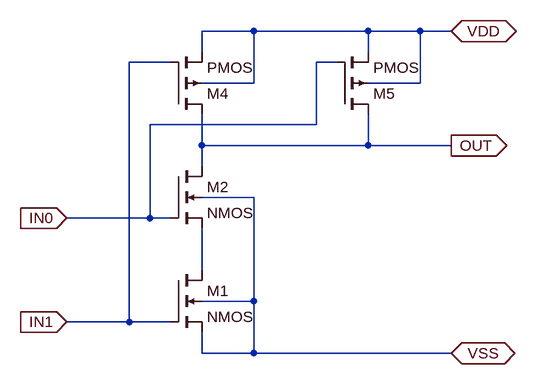
[diagram p0: schematic 2NAND.asc]
2NAND.asc, the LTspice schematic file:
Version 4
SHEET 1 880 680
WIRE 224 -224 144 -224
WIRE 400 -224 224 -224
WIRE 480 -224 400 -224
WIRE 528 -224 480 -224
WIRE 144 -192 144 -224
WIRE 400 -192 400 -224
WIRE 96 -176 32 -176
WIRE 352 -176 320 -176
WIRE 224 -144 224 -224
WIRE 224 -144 144 -144
WIRE 480 -144 480 -224
WIRE 480 -144 400 -144
WIRE 320 -80 320 -176
WIRE 320 -80 64 -80
WIRE 144 -48 144 -96
WIRE 400 -48 400 -96
WIRE 400 -48 144 -48
WIRE 528 -48 400 -48
WIRE 144 -16 144 -48
WIRE 224 32 144 32
WIRE 64 64 64 -80
WIRE 64 64 -64 64
WIRE 96 64 64 64
WIRE 144 144 144 80
WIRE 224 192 224 32
WIRE 224 192 144 192
WIRE 32 224 32 -176
WIRE 32 224 -64 224
WIRE 96 224 32 224
WIRE 144 272 144 240
WIRE 224 272 224 192
WIRE 224 272 144 272
WIRE 528 272 224 272
FLAG 528 -224 VDD
IOPIN 528 -224 BiDir
FLAG 528 272 VSS
IOPIN 528 272 BiDir
FLAG -64 64 IN0
IOPIN -64 64 In
FLAG -64 224 IN1
IOPIN -64 224 In
FLAG 528 -48 OUT
IOPIN 528 -48 Out
SYMBOL nmos4 96 144 R0
SYMATTR InstName M1
SYMATTR Value2 l=110n w=180n
SYMBOL nmos4 96 -16 R0
SYMATTR InstName M2
SYMATTR Value2 l=110n w=180n
SYMBOL pmos4 96 -96 M180
SYMATTR InstName M4
SYMATTR Value2 l=110n w=180n
SYMBOL pmos4 352 -96 M180
SYMATTR InstName M5
SYMATTR Value2 l=110n w=180n

The netlist it stands for:
* 2NAND.asc
M1 N001 IN1 VSS VSS NMOS l=110n w=180n
M2 OUT IN0 N001 VSS NMOS l=110n w=180n
M4 OUT IN1 VDD VDD PMOS l=110n w=180n
M5 OUT IN0 VDD VDD PMOS l=110n w=180n
.model NMOS NMOS
.model PMOS PMOS
.lib standard.mos
.backanno
.end